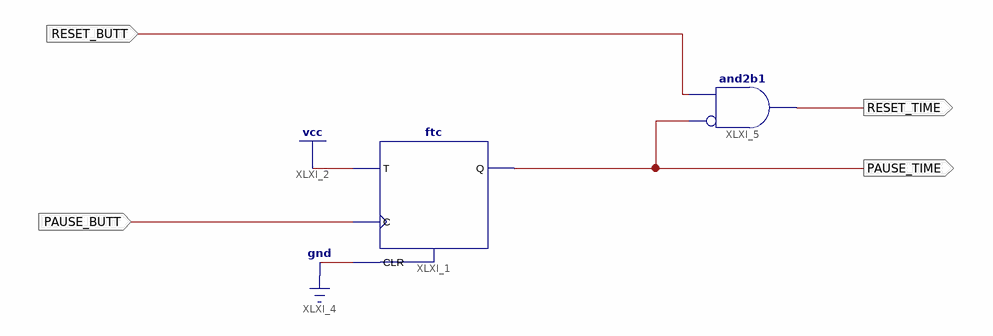
[diagram p0: schematic sheet 1]
// Xilinx ISE schematic BUTT_CTR.sch (spartan6) as structural Verilog: 2 symbols, 4 ports
module BUTT_CTR (
  input  PAUSE_BUTT,
  input  RESET_BUTT,
  output PAUSE_TIME,
  output RESET_TIME
);

  ftc XLXI_1 (.C(PAUSE_BUTT), .CLR(1'b0), .T(1'b1), .Q(PAUSE_TIME));
  and XLXI_5 (RESET_TIME, ~PAUSE_TIME, RESET_BUTT);  // and2b1
endmodule
